# EAGLE design mqttSwitch2.0 (EAGLE 7.7.0)
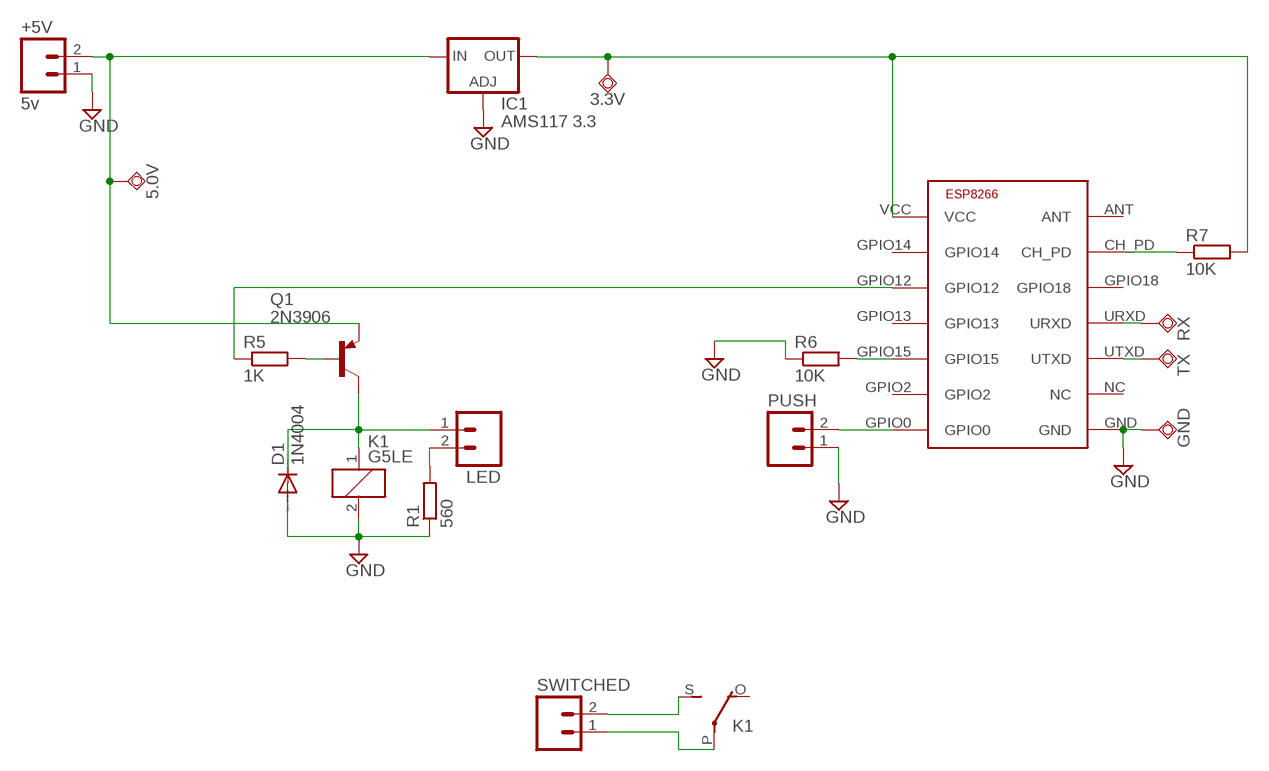
[diagram p0: schematic, sheet 1]

## Parts
3.3V  TPSQTP19R  [TP19R]
5.0V  TPSQTP19R  [TP19R]
+5V  5v  M02PTH  [1X02]
D1  1N4004  [DO41-10]
GND  TPSQTP19R  [TP19R]
IC1  AMS117 3.3  LD117AS33TR  [SOT223]
K1  G5LE  [G5LE]
LED  M02PTH  [1X02]
PUSH  M02PTH  [1X02]
Q1  2N3906  [TO92]
R1  560  R-EU_R0805  [R0805]
R5  1K  R-EU_R0805  [R0805]
R6  10K  R-EU_R0805  [R0805]
R7  10K  R-EU_R0805  [R0805]
RX  TPSQTP19R  [TP19R]
SWITCHED  M02PTH4  [1X02_XTRA_BIG]
TX  TPSQTP19R  [TP19R]
U$1  ESP8266  [ESP-03]

## Nets
GND: +5V.1 D1.A GND.TP IC1.1(ADJ) K1.2 PUSH.1 R1.1 R6.1 U$1.GND
N$1: RX.TP U$1.URXD
N$2: R7.1 U$1.CH_PD
N$3: 3.3V.TP IC1.4(OUT) R7.2 U$1.VCC
N$5: 5.0V.TP +5V.2 IC1.3(IN) Q1.3(E)
N$6: Q1.2(B) R5.2
N$7: R6.2 U$1.GPIO15
N$8: D1.C K1.1 LED.1 Q1.1(C)
N$9: TX.TP U$1.UTXD
N$10: PUSH.2 U$1.GPIO0
N$11: K1.P(2:P) SWITCHED.1
N$12: LED.2 R1.2
N$13: R5.1 U$1.GPIO12
N$14: K1.S(2:S) SWITCHED.2
Unconnected: K1.O(2:O) U$1.ANT U$1.GPIO2 U$1.GPIO13 U$1.GPIO14 U$1.GPIO18 U$1.NC

## Library data of the parts
3.3V 5.0V GND RX TX = testpad:TPSQ: Test pad
+5V LED PUSH SWITCHED = SparkFun-Connectors:M02: Standard 2-pin 0.1" header. Use with - straight break away headers ( PRT-00116) - right angle break away headers (PRT-00553) - swiss pins (PRT-00743) - machine pins (PRT-00117) - female headers (PRT-00115) Molex polarized connector foot print use with: PRT-08233 with associated crimp pins and housings. 2.54_SCREWTERM for use with PRT-10571. 3.5mm Screw Terminal footprints for PRT-08084 5mm Screw Terminal footprints for use with PRT-08432
D1 = diode:1N4004: DIODE general purpose rectifier, 1 A
IC1 = v-reg:LD117A?*: Low drop fixed and adjustable positive voltage regulators 1 A Source: http://www.st.com/stonline/products/literature/ds/7194/ld1117axx.pdf
K1 = relay:G5LE: RELAY 1 x switch, 10 A/120 V AC, 8 A/30 V DC, Omron; OC_FARNELL: unknown; OC_NEWARK: unknown
Q1 = transistor-pnp:2N3906: PNP Transistor
R1 R5-R7 = resistor:R-EU_: RESISTOR, European symbol
U$1 = ESP8266:ESP8266: low cost Wifi to Serial Module

## Board
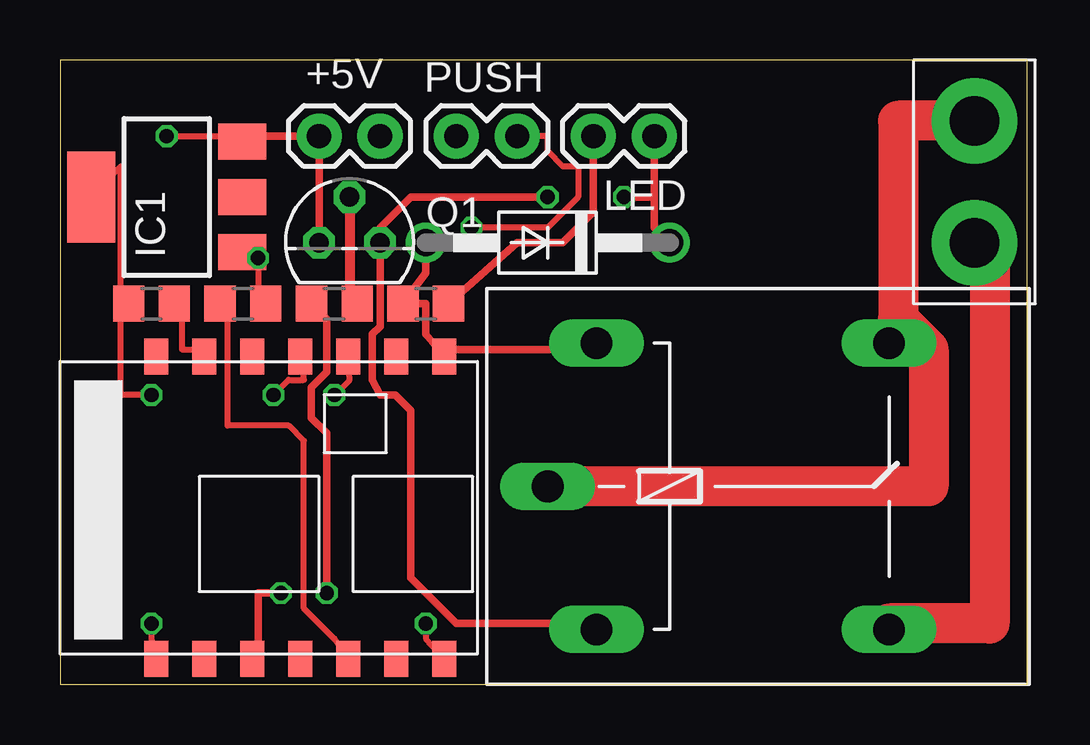
[diagram p1: board, top side]
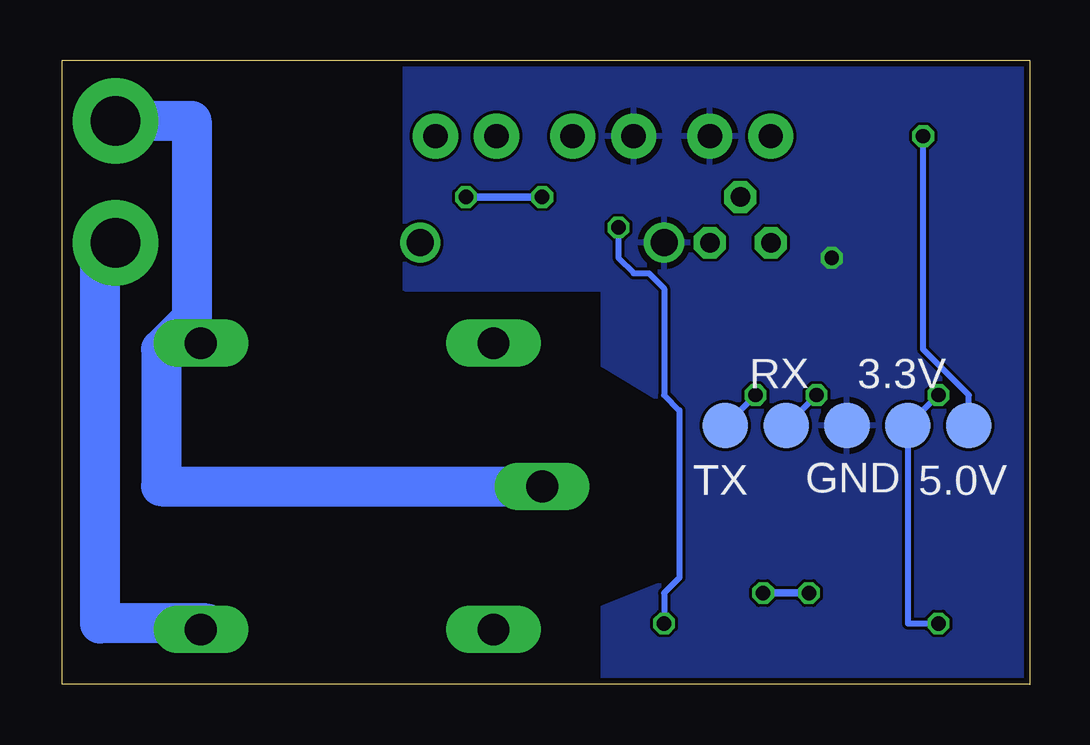
[diagram p2: board, bottom side, seen from below]

Size 40.31 x 26.05 mm. Coordinates in mm from the lower left corner, seen from the top.
Outline: 0,0.01 40.31,0.01 40.31,26.03 0,26.05 0,0.01
Outline: 0,0.01 0,0
Copper layers (1*16): Top 0.035mm / dielectric 1.5mm / Bottom 0.035mm
Design rules "dirt_cheap_dirty_boards.v1 *": minimum track width 5mil, minimum drill 12mil, track to track 5mil, track to pad 5mil, pad to pad 5mil, via to via 5mil, smd to smd 0mil, copper to edge 10mil, drill to drill 10mil, minimum pad ring 10mil, minimum via ring 6mil, stop-mask expansion 2mil, vias tented up to drill 25mil, thermal gap 10mil

### Footprints (pad centres in the part's own frame; a part is rotated, then mirrored left to right if it is on the bottom)
TP19R = smd 1.9 x 1.9: TP 0,0
1X02 = drill 1.016 pad 1.88: 1 0,0; 2 2.54,0
DO41-10 = drill 1.118: A 5.08,0; C -5.08,0
SOT223 = smd 1.5 x 2: 1 -2.3,-3.15; 2 0,-3.15; 3 2.3,-3.15 | smd 3.8 x 2: 4 0,3.15
G5LE = drill 1.321 long: 1 -7.493,-5.969; 2 -7.493,5.969; O 4.699,5.969; P -9.525,0; S 4.699,-5.969
TO92 = drill 0.813 octagon: 1 1.27,0; 2 0,1.905; 3 -1.27,0
R0805 = smd 1.3 x 1.5: 1 -0.95,0; 2 0.95,0
1X02_XTRA_BIG = drill 2.057 pad 3.556: 1 -2.54,0; 2 2.54,0
ESP-03 = smd 1 x 1.5: ANT 4,12.4; CH_PD 6,12.4; GND 16,12.4; GPIO0 16,-0.2; GPIO2 14,-0.2; GPIO12 8,-0.2; GPIO13 10,-0.2; GPIO14 6,-0.2; GPIO15 12,-0.2; GPIO18 8,12.4; NC 14,12.4; URXD 10,12.4; UTXD 12,12.4; VCC 4,-0.2

### Placement (x,y rotation side)
3.3V  5.08,10.8 180 bottom
5.0V  2.54,10.8 180 bottom
+5V  13.33,22.87 180 top
D1  20.32,18.42 180 top
GND  7.62,10.8 0 bottom
IC1  4.45,20.33 90 top
K1  29.85,8.27 0 top
LED  24.77,22.87 180 top
PUSH  16.51,22.87 0 top
Q1  12.06,18.42 0 top
R1  15.24,15.88 0 top
R5  11.43,15.88 0 top
R6  7.62,15.88 180 top
R7  3.81,15.88 180 top
RX  10.16,10.8 180 bottom
SWITCHED  38.1,20.97 270 top
TX  12.7,10.8 180 bottom
U$1  0,1.28 0 top

### Tracks (layer width: path | path; a pad name or v marks a point on that pad's centre or on a via)
GND  (via drill 0.6)
  Top 0.254: v8.26,17.79 8.26,16.52 R6.1
  Top 0.305: D1.A 15.24,17.16 R1.1 15.24,15.88 15.24,14.62 U$1.GND 15.88,13.98 20.96,13.98 K1.2 | v8.26,17.79 IC1.1
  pour Bottom: -0.64,26.68 26.04,26.68 26.04,16.52 17.78,16.52 17.78,13.34 14.61,11.44 14.61,4.45 17.78,3.19 17.78,-0.62 -0.64,-0.62
N$1  (via drill 0.6)
  Top 0.254: v8.89,12.08 9.53,12.71 10.16,12.71 10.16,13.34 U$1.URXD
  Bottom 0.254: RX.TP v8.89,12.08
N$2
  Top 0.254: R7.1 5.08,15.25 5.08,13.98 5.71,13.98 U$1.CH_PD
N$3  (via drill 0.6)
  Top 0.254: v3.81,2.55 3.81,1.91 U$1.VCC | v3.81,12.08 2.54,12.08 2.54,15.25 R7.2 2.54,15.88 2.54,21.6 IC1.4
  Bottom 0.254: v3.81,2.55 5.08,2.55 3.3V.TP v3.81,12.08
N$5  (via drill 0.6)
  Top 0.254: v4.45,22.87 6.98,22.87 IC1.3
  Top 0.305: IC1.3 8.26,22.87 +5V.2 Q1.3
  Bottom 0.254: 5.0V.TP 2.54,12.08 4.45,13.98 v4.45,22.87
N$6
  Top 0.254: 12.06,16.52 R5.2
  Top 0.406: Q1.2 12.06,16.52
N$7
  Top 0.254: U$1.GPIO15 11.43,1.91 10.16,3.19 10.16,10.17 9.53,10.8 6.98,10.8 6.98,15.25 R6.2
N$8  (via drill 0.6)
  Top 0.305: LED.1 24.77,20.33 | 24.77,20.33 24.77,19.06 D1.C | v20.32,20.33 14.61,20.33 13.33,19.06 Q1.1 13.33,14.93 13.02,14.62 13.02,12.71 13.33,12.08 13.97,12.08 14.61,11.44 14.61,4.45 16.51,2.55 20.96,2.55 K1.1 | v23.5,20.33 24.77,20.33
  Bottom 0.305: v20.32,20.33 v23.5,20.33
N$9  (via drill 0.6)
  Top 0.254: U$1.UTXD 12.06,12.71 v11.43,12.08
  Bottom 0.254: TX.TP v11.43,12.08
N$10  (via drill 0.6)
  Top 0.254: v17.15,19.06 20.32,19.06 21.59,20.33 21.59,21.6 20.96,21.6 20.32,22.23 20.32,22.87 PUSH.2 | v15.24,2.55 15.24,1.91 U$1.GPIO0
  Bottom 0.254: v17.15,19.06 17.15,17.79 16.51,17.16 15.88,17.16 15.24,16.52 15.24,12.08 14.61,11.44 14.61,4.45 15.24,3.82 v15.24,2.55
N$11
  Top 1.676: SWITCHED.1 34.92,23.51 34.92,15.25 36.2,13.98 36.2,8.27 K1.P
  Bottom 1.676: SWITCHED.1 34.92,23.51 34.92,15.25 36.2,13.98 36.2,8.27 K1.P
N$12
  Top 0.305: R1.2 19.05,18.42 20.96,18.42 22.23,19.7 LED.2
N$13  (via drill 0.6)
  Top 0.305: R5.1 11.11,15.25 11.11,13.03 10.48,12.39 10.48,11.12 11.11,10.49 v11.11,3.82 | v9.21,3.82 8.26,3.82 8.26,1.28 U$1.GPIO12
  Bottom 0.305: v11.11,3.82 v9.21,3.82
N$14
  Top 1.676: SWITCHED.2 38.73,18.42 38.73,2.55 34.54,2.55 K1.S
  Bottom 1.676: 34.29,2.55 38.73,2.55 38.73,18.42 SWITCHED.2